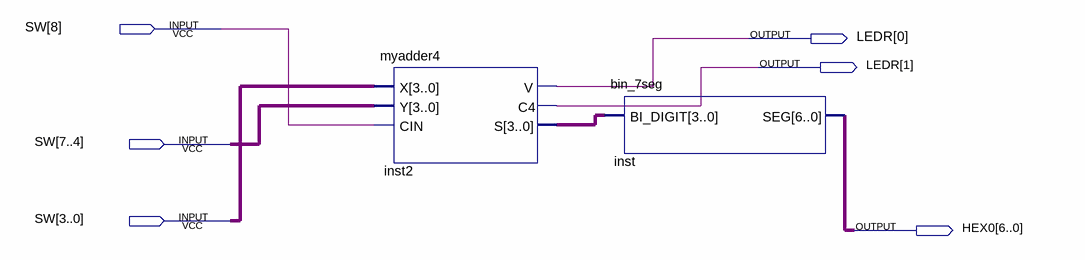
[diagram p0: schematic sheet]
// Quartus schematic lab5.bdf as structural Verilog: 2 symbols, 6 pins
module lab5 (
  input  [8:0] SW,
  output [1:0] LEDR,
  output [6:0] HEX0
);

  wire [3:0] inst2_s;

  myadder4 inst2 (.X(SW[3:0]), .Y(SW[7:4]), .CIN(SW[8]), .V(LEDR[0]), .C4(LEDR[1]), .S(inst2_s));
  bin_7seg inst (.BI_DIGIT(inst2_s), .SEG(HEX0));
endmodule
